# EasyEDA schematic SP26_brainstim3_Sig_Gen_1channel_schematic_Jack_Mertes.json
TITLE: Sheet_1; REV: 1.0; Date: 2026-03-18; Sheet: 1/1; Drawn By: jacksonmertes; Company: Your Company
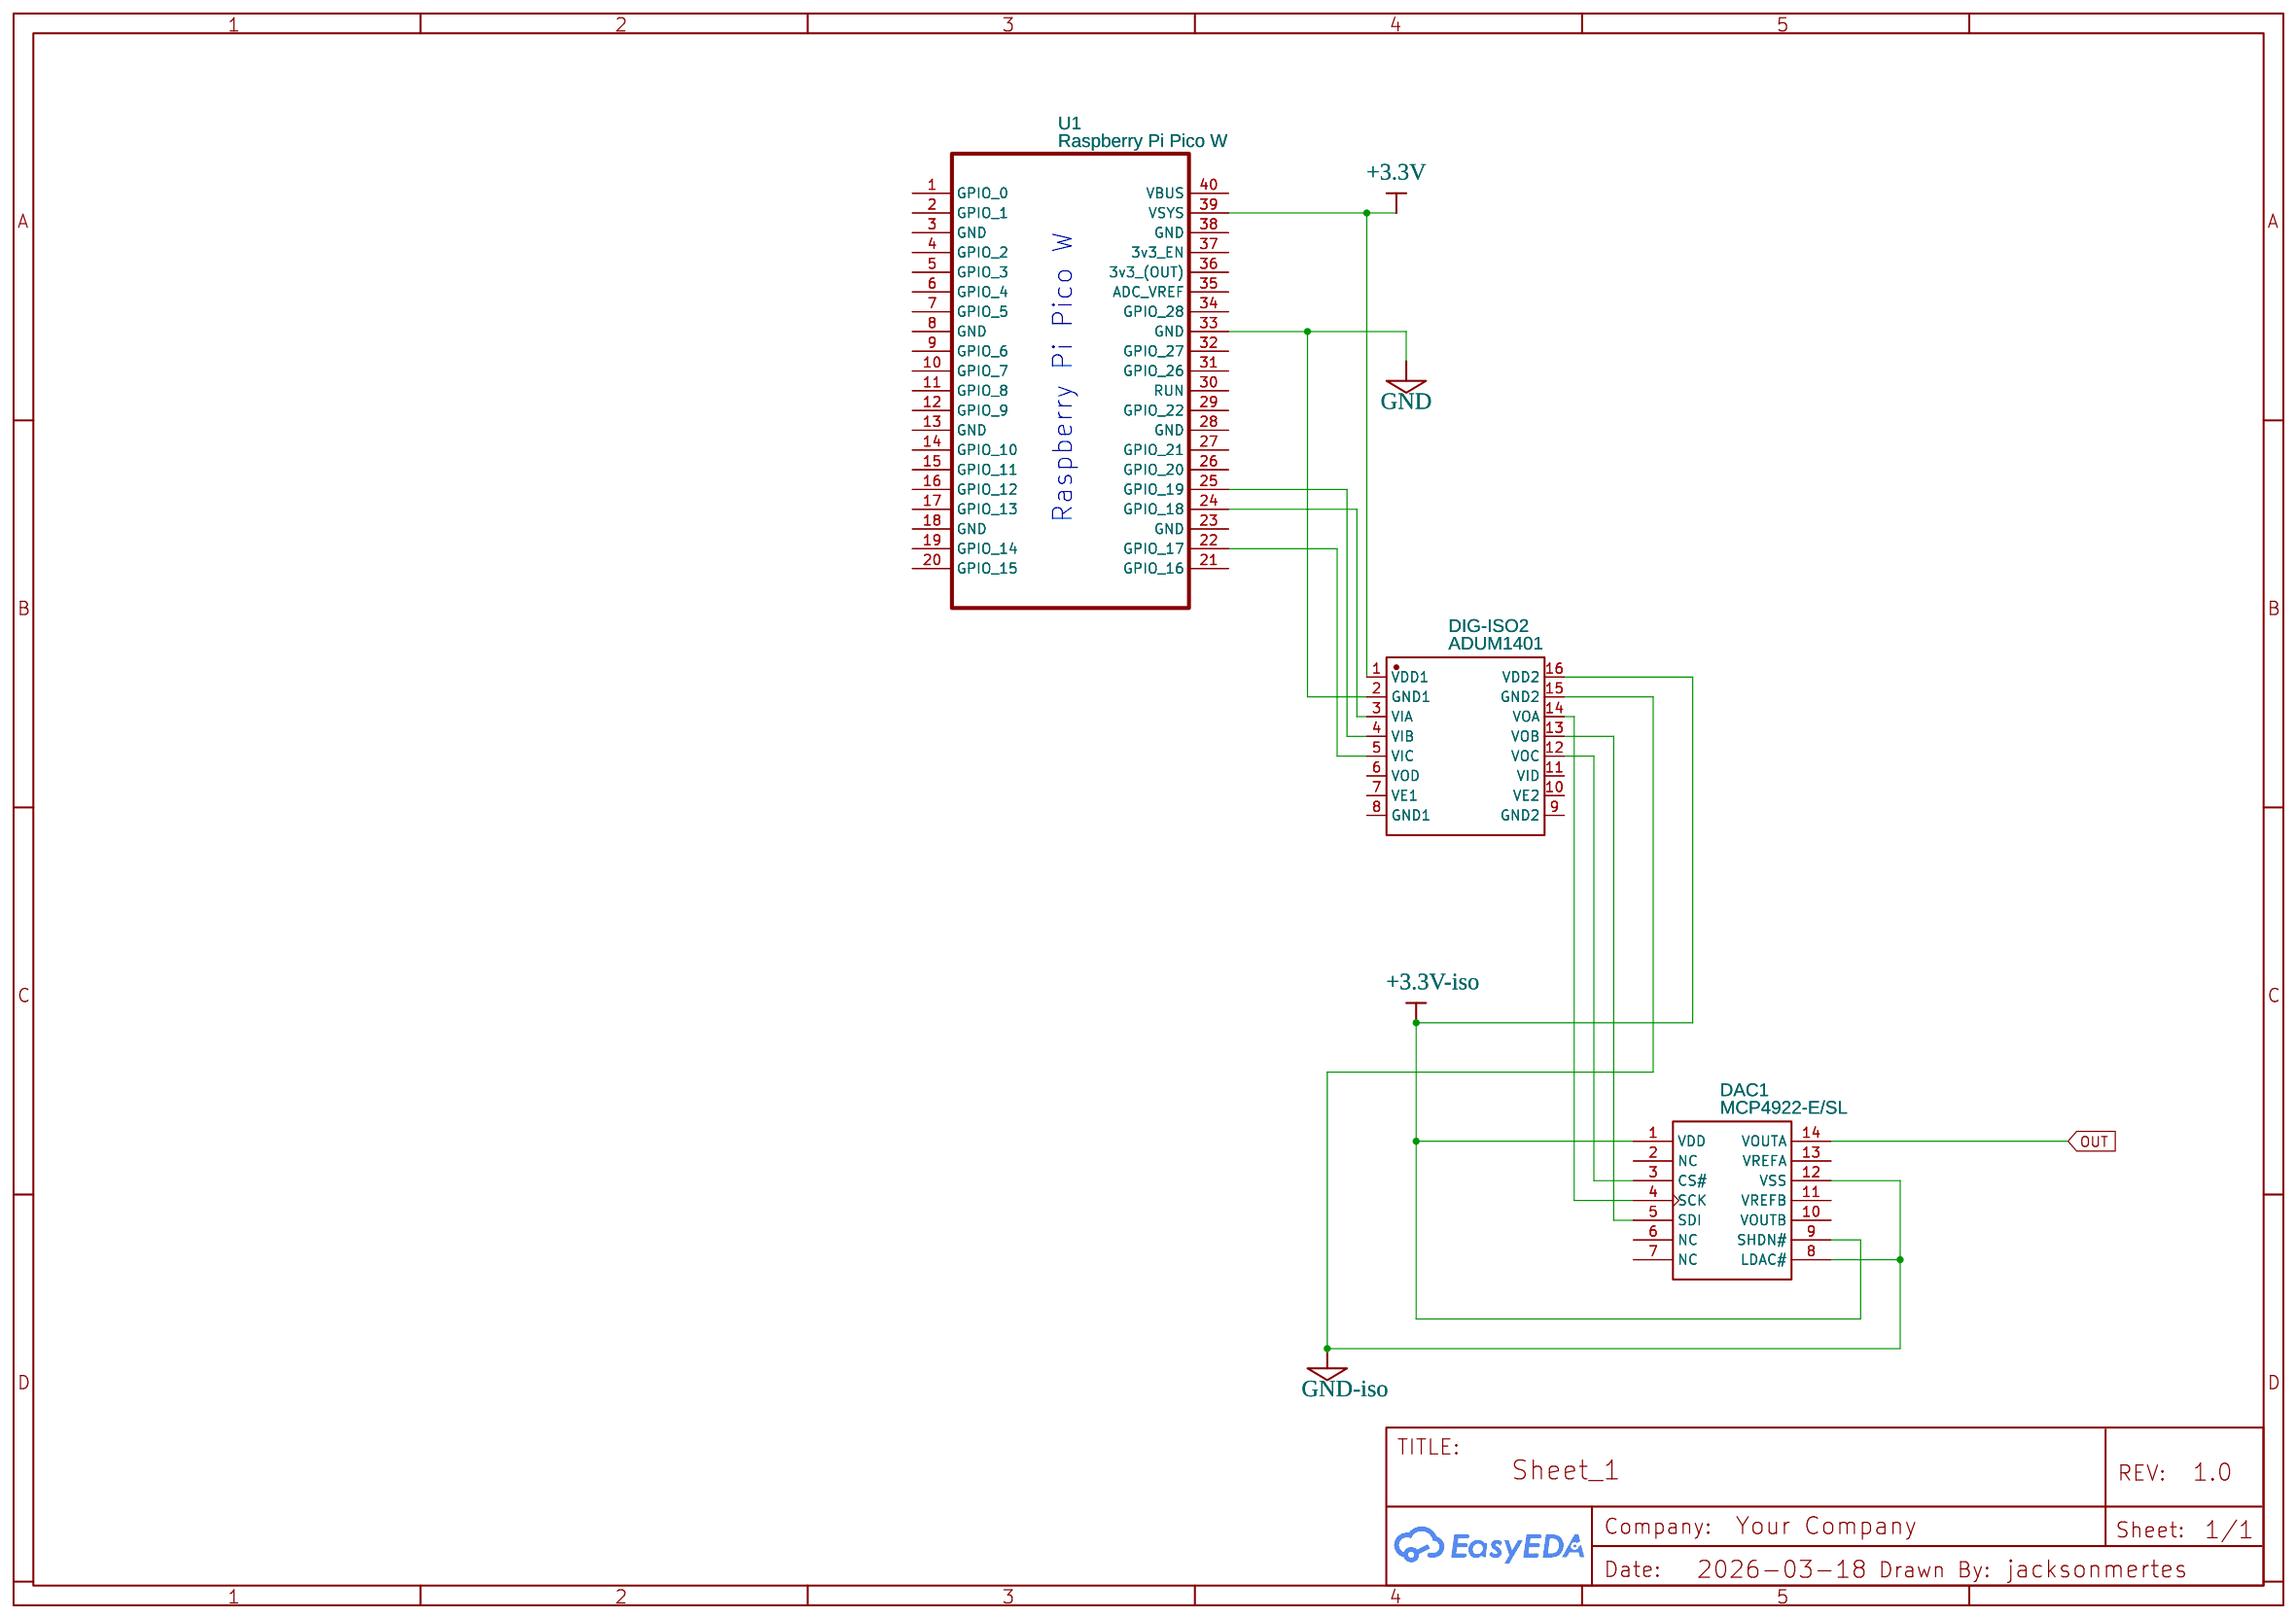
[diagram p0: schematic sheet]

## Parts
DAC1  MCP4922-E/SL  [SOIC-14_L8.7-W3.9-P1.27-LS6.0-BL]
DIG-ISO2  ADUM1401  [SOIC-16_L10.3-W7.5-P1.27-LS10.3-BL]
U1  Raspberry Pi Pico W  [RASPBERRY PI PICO/ RASPBERRY PI PICO W]

## Library data of the parts
DAC1 = MCP4922-E/SL: Supplier: LCSC; Manufacturer: MICROCHIP(美国微芯); Supplier Part: C39851; JLCPCB Part Class: Extended Part; Contributor: Diego Arruda da Silveira
DIG-ISO2 = ADUM1401ARWZ-RL: Supplier: LCSC; Supplier Part: C201135; Manufacturer: Analog Devices; Contributor: inenarokomov; LCSC Assembly: Yes; SMT Type: Extend
U1 = Raspberry Pi Pico W: Manufacturer: Raspberry Pi; Manufacturer Part: PICO W; Supplier Part: C7203003; Supplier: LCSC; Contributor: lynxaniya

## Nets
+3.3V: DIG-ISO2.1(VDD1) U1.39(VSYS)
+3.3V-iso: DAC1.1(VDD) DAC1.9(SHDN#) DIG-ISO2.16(VDD2)
GND: DIG-ISO2.2(GND1) U1.33(GND)
GND-iso: DAC1.8(LDAC#) DAC1.12(VSS) DIG-ISO2.15(GND2)
OUT: DAC1.14(VOUTA)
Net-(DAC1-3): DAC1.3(CS#) DIG-ISO2.12(VOC)
Net-(DAC1-4): DAC1.4(SCK) DIG-ISO2.14(VOA)
Net-(DAC1-5): DAC1.5(SDI) DIG-ISO2.13(VOB)
Net-(DIG-ISO2-3): DIG-ISO2.3(VIA) U1.24(GPIO 18)
Net-(DIG-ISO2-4): DIG-ISO2.4(VIB) U1.25(GPIO 19)
Net-(DIG-ISO2-5): DIG-ISO2.5(VIC) U1.22(GPIO 17)

Not connected (* = marked no-connect by the designer): DAC1 2(NC) 6(NC) 7(NC) 10(VOUTB) 11(VREFB) 13(VREFA); DIG-ISO2 6(VOD) 7(VE1) 8(GND1) 9(GND2) 10(VE2) 11(VID); U1 1(GPIO 0) 2(GPIO 1) 3(GND) 4(GPIO 2) 5(GPIO 3) 6(GPIO 4) 7(GPIO 5) 8(GND) 9(GPIO 6) 10(GPIO 7) 11(GPIO 8) 12(GPIO 9) 13(GND) 14(GPIO 10) 15(GPIO 11) 16(GPIO 12) 17(GPIO 13) 18(GND) 19(GPIO 14) 20(GPIO 15) 21(GPIO 16) 23(GND) 26(GPIO 20) 27(GPIO 21) 28(GND) 29(GPIO 22) 30(RUN) 31(GPIO 26) 32(GPIO 27) 34(GPIO 28) 35(ADC_VREF) 36(3v3 (OUT)) 37(3v3_EN) 38(GND) 40(VBUS)

## Notes on the sheet
- Raspberry Pi Pico W
